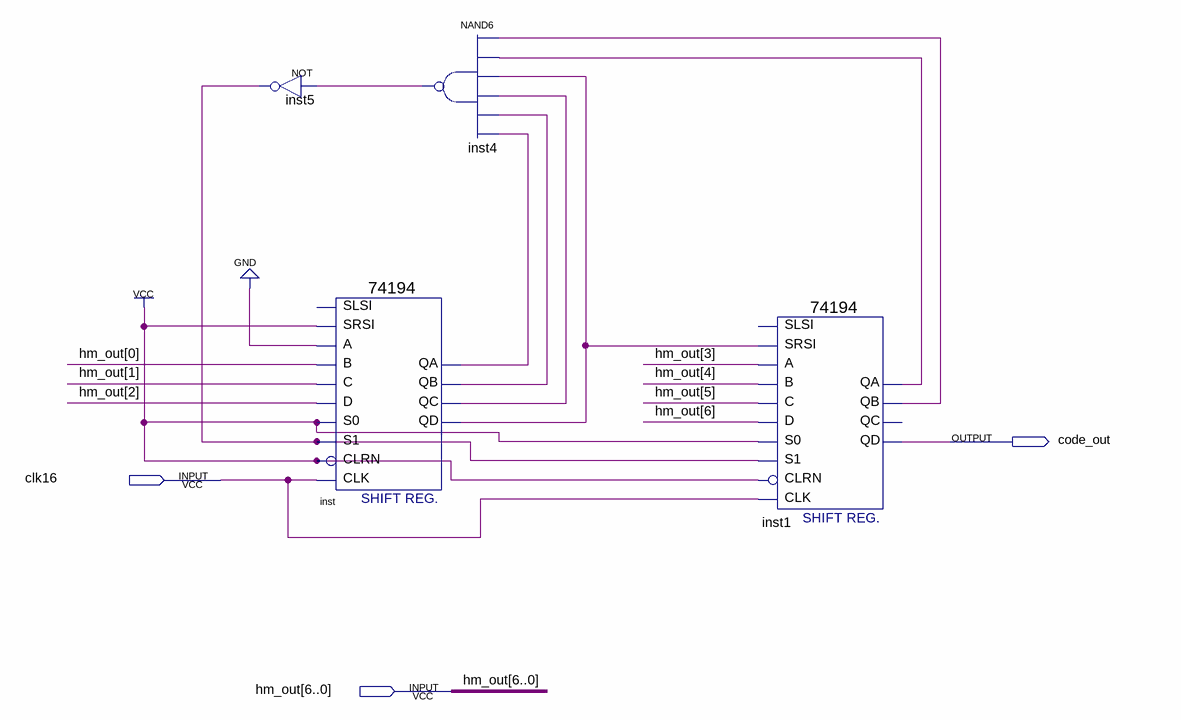
[diagram p0: schematic sheet]
// Quartus schematic bing_to_chuan.bdf as structural Verilog: 4 symbols, 3 pins
module bing_to_chuan (
  input  clk16,
  input  [6:0] hm_out,
  output code_out
);

  wire inst1_qa, inst1_qb, inst4_out, inst5_out, inst_qa, inst_qb, inst_qc, inst_qd;

  not inst5 (inst5_out, inst4_out);
  \74194  inst (
    .SRSI(1'b1), .B(hm_out[0]), .C(hm_out[1]), .CLK(clk16), .CLRN(1'b1), .D(hm_out[2]), .S1(inst5_out),
    .S0(1'b1), .A(1'b0), .QA(inst_qa), .QB(inst_qb), .QC(inst_qc), .QD(inst_qd));  // open: SLSI
  nand inst4 (inst4_out, inst1_qb, inst1_qa, inst_qd, inst_qc, inst_qb, inst_qa);
  \74194  inst1 (
    .SRSI(inst_qd), .B(hm_out[4]), .C(hm_out[5]), .CLK(clk16), .CLRN(1'b1), .D(hm_out[6]), .S1(inst5_out),
    .S0(1'b1), .A(hm_out[3]), .QA(inst1_qa), .QB(inst1_qb), .QD(code_out));  // open: SLSI, QC
endmodule
